# EasyEDA Pro project ProPrj_遥控_2024-09-10.epro

# Schematic Schematic1
Board Name: Board1; Create Date: 2024-09-09
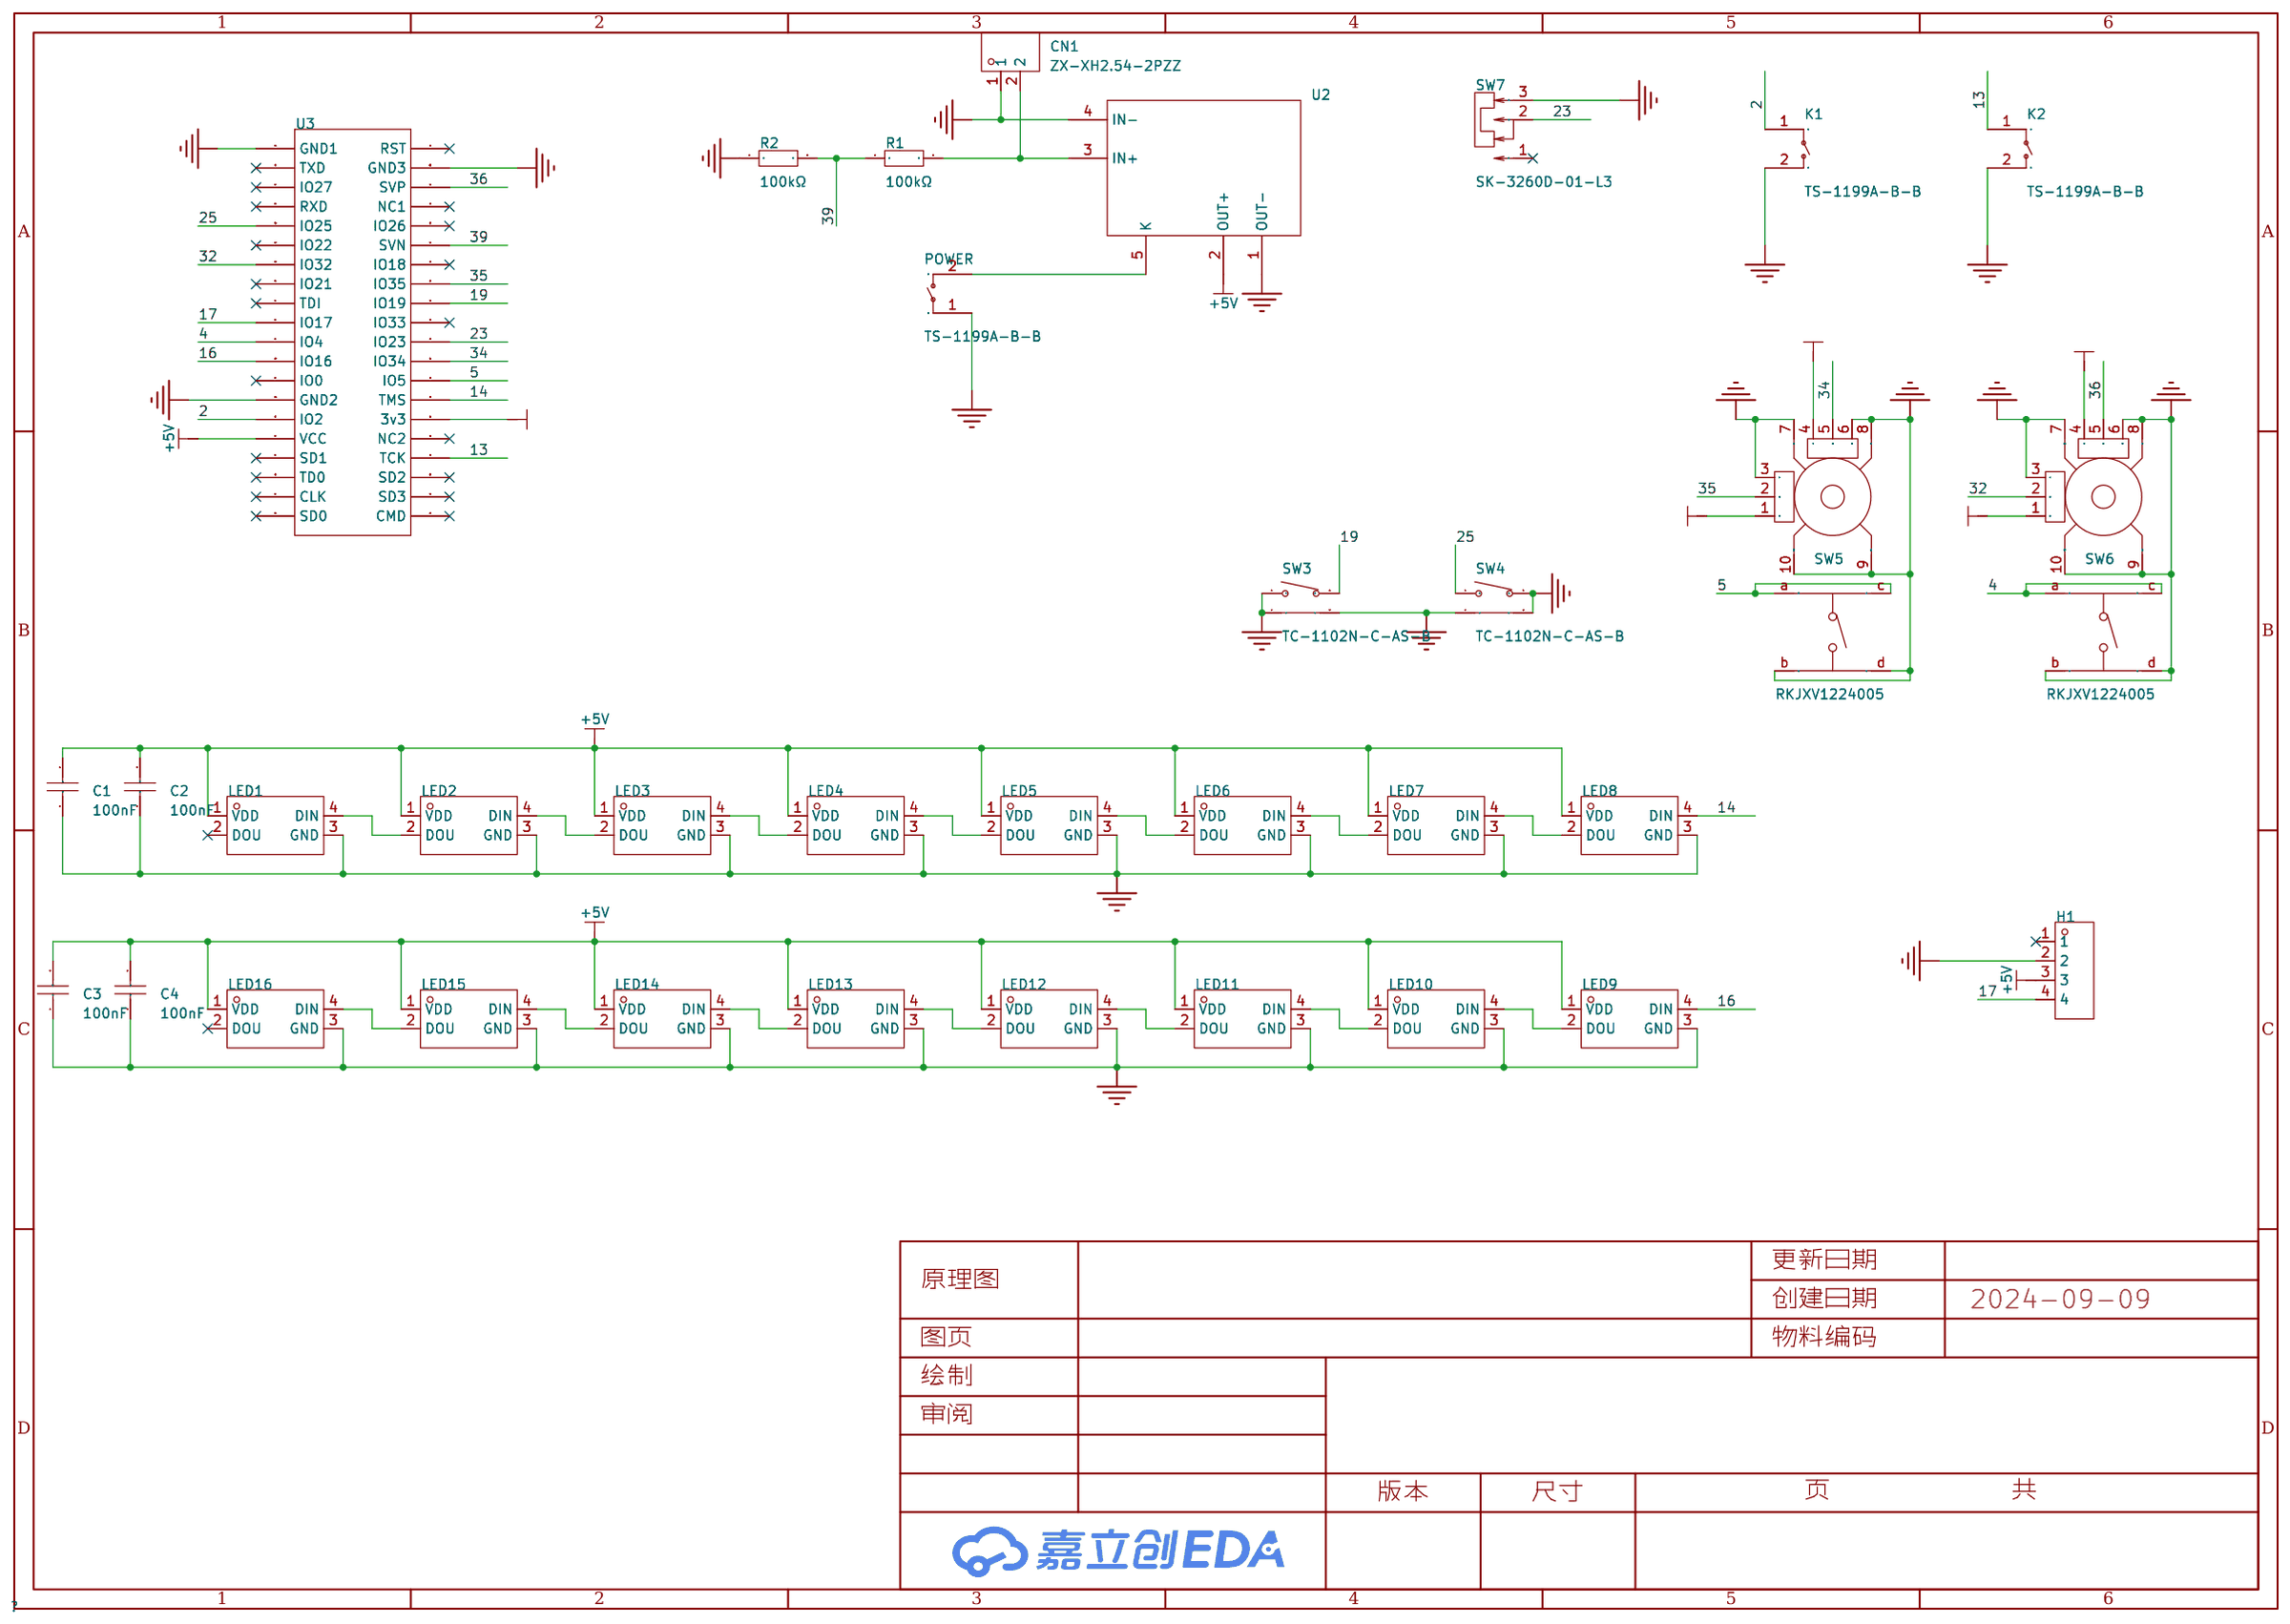
[diagram p0: schematic sheet]

## Parts
C1  100nF  [C0805]
C2  100nF  [C0805]
C3  100nF  [C0805]
C4  100nF  [C0805]
CN1  ZX-XH2.54-2PZZ  [CONN-TH_2P-P2.50_HX25003-2A]
H1  -  [HDR-TH_4P-P2.54-V-M]
K1  TS-1199A-B-B  [SW-SMD_L6.0-W6.0-P6.00-LS6.6]
K2  TS-1199A-B-B  [SW-SMD_L6.0-W6.0-P6.00-LS6.6]
LED1  XL-5050RGBC-WS2812B  [LED-SMD_4P-L5.0-W5.0-BL_XL-5050RGBC]
LED2  XL-5050RGBC-WS2812B  [LED-SMD_4P-L5.0-W5.0-BL_XL-5050RGBC]
LED3  XL-5050RGBC-WS2812B  [LED-SMD_4P-L5.0-W5.0-BL_XL-5050RGBC]
LED4  XL-5050RGBC-WS2812B  [LED-SMD_4P-L5.0-W5.0-BL_XL-5050RGBC]
LED5  XL-5050RGBC-WS2812B  [LED-SMD_4P-L5.0-W5.0-BL_XL-5050RGBC]
LED6  XL-5050RGBC-WS2812B  [LED-SMD_4P-L5.0-W5.0-BL_XL-5050RGBC]
LED7  XL-5050RGBC-WS2812B  [LED-SMD_4P-L5.0-W5.0-BL_XL-5050RGBC]
LED8  XL-5050RGBC-WS2812B  [LED-SMD_4P-L5.0-W5.0-BL_XL-5050RGBC]
LED9  XL-5050RGBC-WS2812B  [LED-SMD_4P-L5.0-W5.0-BL_XL-5050RGBC]
LED10  XL-5050RGBC-WS2812B  [LED-SMD_4P-L5.0-W5.0-BL_XL-5050RGBC]
LED11  XL-5050RGBC-WS2812B  [LED-SMD_4P-L5.0-W5.0-BL_XL-5050RGBC]
LED12  XL-5050RGBC-WS2812B  [LED-SMD_4P-L5.0-W5.0-BL_XL-5050RGBC]
LED13  XL-5050RGBC-WS2812B  [LED-SMD_4P-L5.0-W5.0-BL_XL-5050RGBC]
LED14  XL-5050RGBC-WS2812B  [LED-SMD_4P-L5.0-W5.0-BL_XL-5050RGBC]
LED15  XL-5050RGBC-WS2812B  [LED-SMD_4P-L5.0-W5.0-BL_XL-5050RGBC]
LED16  XL-5050RGBC-WS2812B  [LED-SMD_4P-L5.0-W5.0-BL_XL-5050RGBC]
POWER  TS-1199A-B-B  [SW-SMD_L6.0-W6.0-P6.00-LS6.6]
R1  100kΩ  [R0805]
R2  100kΩ  [R0805]
SW3  TC-1102N-C-AS-B  [SW-TH_TC-1102N-C-AS-B]
SW4  TC-1102N-C-AS-B  [SW-TH_TC-1102N-C-AS-B]
SW5  RKJXV1224005  [SW-TH_RKJXV1224005]
SW6  RKJXV1224005  [SW-TH_RKJXV1224005]
SW7  SK-3260D-01-L3  [SW-TH_SK-3260D-01-LX]
U2  -  [5V模块]
U3  -  [ESP32MINIKIT]

## Library data of the parts
C1-C4 = CC0805KRX7R9BB104: 容值:100nF;精度:±10%;额定电压:50V;材质(温度系数):X7R;; LCSC Part Name: 100nF ±10% 50V; Supplier Part: C49678; Manufacturer: YAGEO(国巨); Supplier Footprint: 0805; JLCPCB Part Class: 基础库; Datasheet: https://atta.szlcsc.com/upload/public/pdf/source/20180224/C181747_15194369449651363981.pdf; Supplier: LCSC; Tolerance: ±10%; Voltage Rated: 50V; Temperature Coefficient: X7R
CN1 = ZX-XH2.54-2PZZ: 插针结构:1x2P;间距:2.54mm;安装方式:直插;参考系列:XH;总PIN数:2P;排数:1;每排PIN数:2;行距:-;额定电流:3A;触头材质:黄铜;触头镀层:锡;工作温度范围:-25℃~+85℃;; Supplier Part: C7429632; Manufacturer: Megastar(兆星); Supplier Footprint: 插件,P=2.54mm; JLCPCB Part Class: 扩展库; Datasheet: https://atta.szlcsc.com/upload/public/pdf/source/20230619/19BA6947230AA44A04D3EDD65E618FD0.pdf; Supplier: LCSC; Pins Structure: 1x2P; Pitch: 2.54mm; Mounting Style: 直插; Reference Series: XH; Number of Pins: 2P; Number of Rows: 1; Number of PINs Per Row: 2; Current Rating (Max): 3A; Contact Material: 黄铜; Contact Plating: 锡; Operating Temperature Range: -25℃~+85℃
H1 = HDR-M_2.54_1x4P: Supplier Part: C492403; Supplier Footprint: 插件
K1 K2 POWER = TS-1199A-B-B: 电路结构:单刀单掷;按钮形状:圆形按钮;作用力:200gf;安装方式:立贴;开关长度:6mm;开关宽度:6mm;开关高度:5mm;带支架:不带;触点电流:50mA;额定电压(DC):12V;绝缘电阻:-;带灯:无;机械寿命:10万次;; LCSC Part Name: 6*6*5mm 立贴 轻触开关; Supplier Part: C692476; Manufacturer: XKB Connectivity(中国星坤); Supplier Footprint: SMD; JLCPCB Part Class: 扩展库; Datasheet: https://atta.szlcsc.com/upload/public/pdf/source/20211011/5E46F02732EE66B7CDC1B0DB682D7B62.pdf; Supplier: LCSC; Circuit: 单刀单掷; Actuator Style: 圆形按钮; Operating Force: 200gf; Mounting Style: 立贴; Switch Length: 6mm; Switch Width: 6mm; Switch Height: 5mm; Strike Gundam: 不带; Contact Current: 50mA; Voltage Rating (DC): 12V; Actuator/Cap Color: 黑色; With Lamp: 无; Mechanical Life: 10万次; Operating Temperature: -30℃~+85℃
LED1-LED16 = XL-5050RGBC-WS2812B: 5050七彩幻彩透明贴片LED灯珠 5050 幻彩透明四脚 ws2812B 内置驱动IC; Supplier Part: C2843785; Manufacturer: XINGLIGHT(成兴光); Supplier Footprint: SMD5050; JLCPCB Part Class: 扩展库; Datasheet: https://atta.szlcsc.com/upload/public/pdf/source/20240412/E1004CAA80592E31D08BFE019083806F.pdf; Supplier: LCSC
R1 R2 = 0805W8F1003T5E: 电阻类型:厚膜电阻;阻值:100kΩ;精度:±1%;功率:125mW;最大工作电压:150V;温度系数:±100ppm/℃;; LCSC Part Name: 100kΩ ±1% 125mW 厚膜电阻; Supplier Part: C149504; Manufacturer: UNI-ROYAL(厚声); Supplier Footprint: 0805; JLCPCB Part Class: 基础库; Datasheet: https://atta.szlcsc.com/upload/public/pdf/source/20200306/C422600_1E6D84923E4A46A82E41ADD87F860B5C.pdf; Supplier: LCSC; Type: 厚膜电阻; Tolerance: ±1%; Power(Watts): 125mW; Overload Voltage (Max): 150V; Temperature Coefficient: ±100ppm/℃; Operating Temperature Range: -55℃~+155℃
SW3 SW4 = TC-1102N-C-AS-B: 电路结构:单刀单掷;按钮形状:圆形按钮;作用力:260gf;安装方式:卧插;开关长度:6mm;开关宽度:6mm;开关高度:4.5mm;带支架:带支架;触点电流:50mA;额定电压(DC):12V;绝缘电阻:-;带灯:无;机械寿命:30万次;; LCSC Part Name: 6*6*4.5mm 卧插 轻触开关; Supplier Part: C406151; Manufacturer: XKB Connectivity(中国星坤); Supplier Footprint: 插件; JLCPCB Part Class: 扩展库; Datasheet: https://atta.szlcsc.com/upload/public/pdf/source/20211011/8943A334D21548136505FDDC6F7285B9.pdf; Supplier: LCSC; Circuit: 单刀单掷; Actuator Style: 圆形按钮; Operating Force: 260gf; Mounting Style: 卧插; Switch Length: 6mm; Switch Width: 6mm; Switch Height: 4.5mm; Strike Gundam: 带支架; Contact Current: 50mA; Voltage Rating (DC): 12V; Actuator/Cap Color: 黑色; With Lamp: 无; Pin Style: PC引脚; Mechanical Life: 30万次; Operating Temperature: -30℃~+85℃
SW5 SW6 = RKJXV1224005: 操纵杆复位 中央按动开关 适用于航模玩具遥控器电位器、3D摇杆PS4手柄游戏机、无人机摇杆电位器、工业控制器; Supplier Part: C146170; Manufacturer: ALPSALPINE(阿尔卑斯阿尔派); Supplier Footprint: 插件,13x13mm; JLCPCB Part Class: 扩展库; Datasheet: https://atta.szlcsc.com/upload/public/pdf/source/20180125/C146170_15168615510911301620.pdf; Supplier: LCSC
SW7 = SK-3260D-01-L3: 电路结构:单刀双掷;安装方式:侧插;开关颜色:黑色;额定电流(DC):50mA;额定电压(DC):12V;额定电流(AC):50mA;额定电压(AC):12V;机械寿命:1万次;; LCSC Part Name: 柄长3mm 卧插双档 滑动开关; Supplier Part: C692482; Manufacturer: XKB Connectivity(中国星坤); Supplier Footprint: 插件; JLCPCB Part Class: 扩展库; Datasheet: https://atta.szlcsc.com/upload/public/pdf/source/20211009/221EDC0F79A971BF29F08D53B29B73D7.pdf; Supplier: LCSC; Circuit: 单刀双掷; Actuator Style: 矩形柱状; Pin Style: PC引脚; Switch Length: 9mm; Switch Width: 3.2mm; Switch Height: 3.6mm; Mounting Style: 侧插; Actuator Color: 黑色; Current Rating (DC): 50mA; Voltage Rating (DC): 12V; Current Rating (AC): 50mA; Voltage Rating (AC): 12V; Mechanical Life: 1万次; Operating Temperature: -40℃~+85℃
U2 = 5V模块
U3 = esp32minikit

## Nets
3.3V: SW5.1(B) SW5.4(A) SW6.1(B) SW6.4(A) U3.3v3
+5V: C1.2 C2.2 C3.2 C4.2 H1.3 LED1.1(VDD) LED2.1(VDD) LED3.1(VDD) LED4.1(VDD) LED5.1(VDD) LED6.1(VDD) LED7.1(VDD) LED8.1(VDD) LED9.1(VDD) LED10.1(VDD) LED11.1(VDD) LED12.1(VDD) LED13.1(VDD) LED14.1(VDD) LED15.1(VDD) LED16.1(VDD) U2.2(OUT+) U3.VCC
GND: C1.1 C2.1 C3.1 C4.1 CN1.1 H1.2 K1.2 K2.2 LED1.3(GND) LED2.3(GND) LED3.3(GND) LED4.3(GND) LED5.3(GND) LED6.3(GND) LED7.3(GND) LED8.3(GND) LED9.3(GND) LED10.3(GND) LED11.3(GND) LED12.3(GND) LED13.3(GND) LED14.3(GND) LED15.3(GND) LED16.3(GND) POWER.1 R2.1 SW3.1 SW3.3 SW3.4 SW4.2 SW4.3 SW4.4 SW5.3(A) SW5.6(B) SW5.7(GND) SW5.8(GND) SW5.9(GND) SW5.10(GND) SW5.b SW5.d SW6.3(A) SW6.6(B) SW6.7(GND) SW6.8(GND) SW6.9(GND) SW6.10(GND) SW6.b SW6.d SW7.3 U2.1(OUT-) U2.4(IN-) U3.GND1 U3.GND2 U3.GND3
2: K1.1 U3.IO2
4: SW6.a SW6.c U3.IO4
5: SW5.a SW5.c U3.IO5
13: K2.1 U3.TCK
14: LED8.4(DIN) U3.TMS
16: LED9.4(DIN) U3.IO16
17: H1.4 U3.IO17
19: SW3.2 U3.IO19
23: SW7.2 U3.IO23
25: SW4.1 U3.IO25
32: SW6.2(DTA) U3.IO32
34: SW5.5(DTA) U3.IO34
35: SW5.2(DTA) U3.IO35
36: SW6.5(DTA) U3.SVP
39: R1.1 R2.2 U3.SVN
$1N2649: LED1.4(DIN) LED2.2(DOU)
$1N2655: LED2.4(DIN) LED3.2(DOU)
$1N2662: LED3.4(DIN) LED4.2(DOU)
$1N2669: LED4.4(DIN) LED5.2(DOU)
$1N2676: LED5.4(DIN) LED6.2(DOU)
$1N2683: LED6.4(DIN) LED7.2(DOU)
$1N2690: LED7.4(DIN) LED8.2(DOU)
$1N2754: LED15.2(DOU) LED16.4(DIN)
$1N2758: LED14.2(DOU) LED15.4(DIN)
$1N2762: LED13.2(DOU) LED14.4(DIN)
$1N2766: LED12.2(DOU) LED13.4(DIN)
$1N2770: LED11.2(DOU) LED12.4(DIN)
$1N2774: LED10.2(DOU) LED11.4(DIN)
$1N2778: LED9.2(DOU) LED10.4(DIN)
$1N3572: CN1.2 R1.2 U2.3(IN+)
$1N3580: POWER.2 U2.5(K)

Not connected (* = marked no-connect by the designer): H1 1*; LED1 2(DOU)*; LED16 2(DOU)*; SW7 1*; U3 CLK* CMD* IO0* IO18* IO21* IO22* IO26* IO27* IO33* NC1* NC2* PST(RST)* RXD* SD0* SD1* SD2* SD3* TD0* TDI* TXD*

# Board PCB1
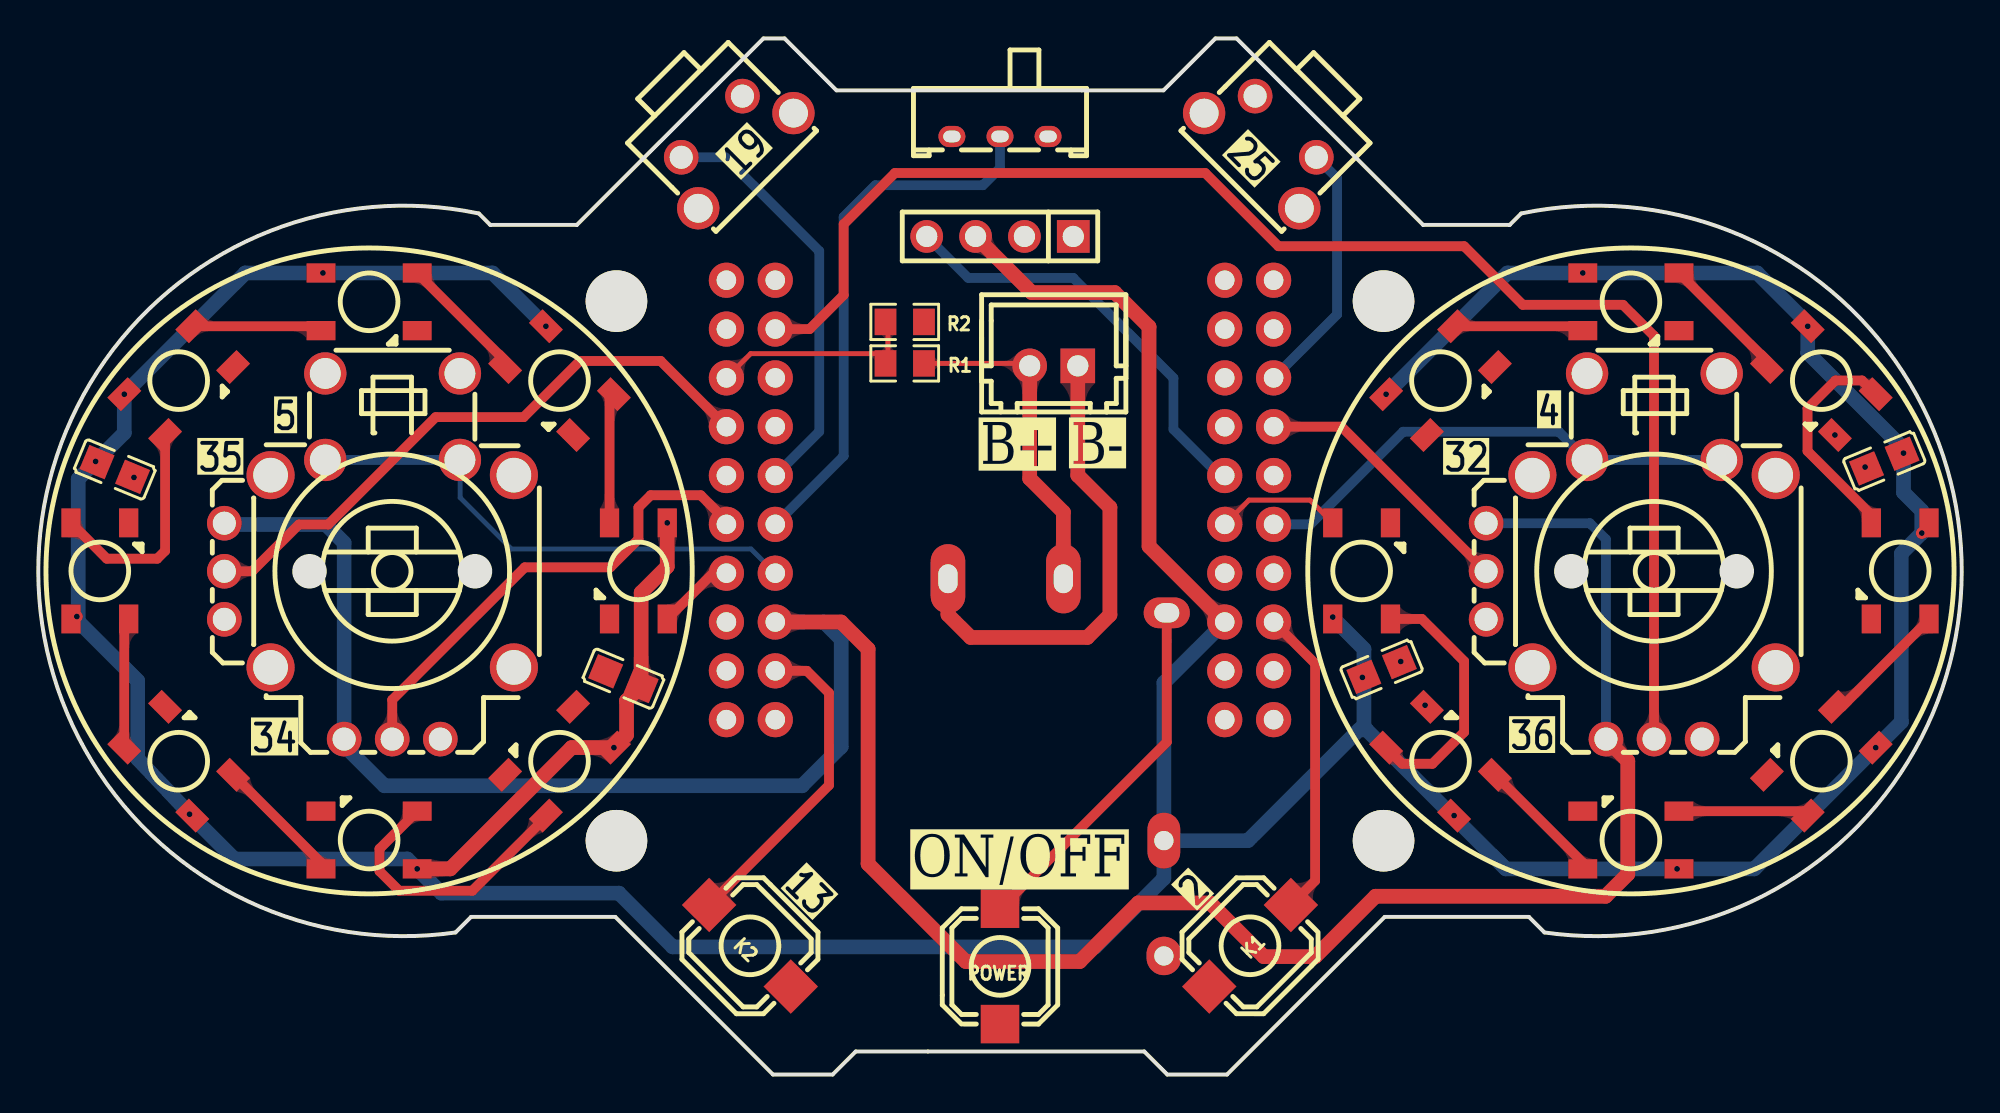
[diagram p1: board, top side]
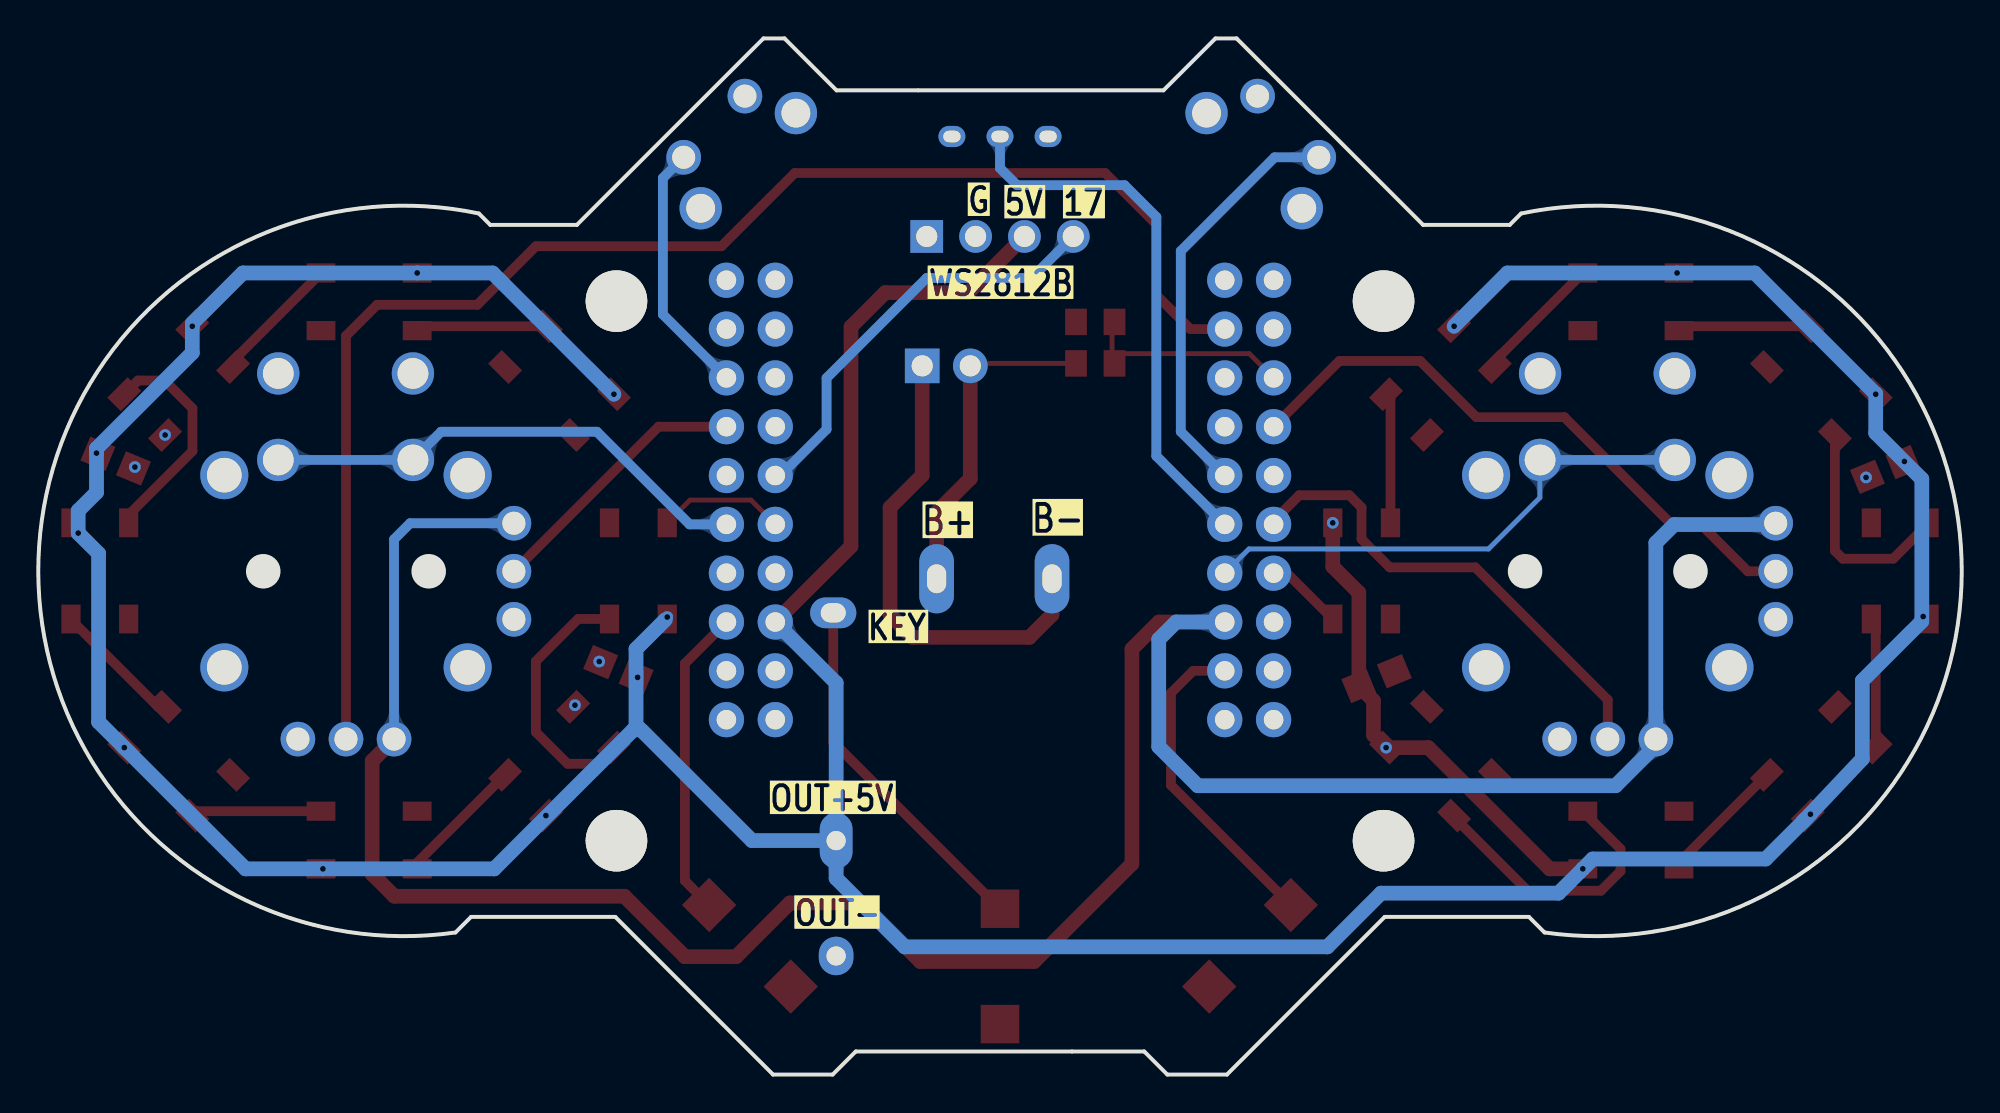
[diagram p2: board, bottom side, seen from below]

Outline 99.98 x 53.9 mm; copper layers: Top Layer, Bottom Layer. Coordinates in mm from the lower left corner of the outline.
Outline path: 21.68,7.39 22.49,8.2 29.99,8.2 38.19,0 41.29,0 42.49,1.2 57.49,1.2 58.69,0 61.79,0 69.99,8.2 77.49,8.2 78.3,7.39 arc(99.98,26.82) 77.08,44.79 76.49,44.2 71.99,44.2 62.29,53.9 61.19,53.9 58.49,51.2 41.49,51.2 38.79,53.9 37.69,53.9 27.99,44.2 23.49,44.2 22.89,44.79 arc(0,26.82) 21.68,7.39
Stack: Top Layer 0.035mm / Dielectric1 1.51mm FR4 er 4.5 / Bottom Layer 0.035mm

## Design rules (mm)
template: JLCPCB Capability(Two Layers Board)
spacing copperThickness1oz (default): track to track 0.102, other pairs 0.152 to 0.3
spacing copperThickness2oz: track to track 0.203, other pairs 0.152 to 0.3
track width copperThickness1oz (default): min 0.127, default 0.254, max 2.54
track width copperThickness2oz: min 0.203, default 0.254, max 2.54
differential pair differentialPair (default): width min 0.127, default 0.254, max 2.54; gap min 0.152, default 0.152
via viaSize (default): diameter min 0.5, default 0.61, max 10; hole min 0.3, default 0.305, max 6.3

## Placement (name value [footprint] x y rotation side)
C1  100nF  [C0805]  3.97 31.48 157.5 top
C2  100nF  [C0805]  30.41 20.59 337.5 top
C3  100nF  [C0805]  95.96 31.91 22.5 top
C4  100nF  [C0805]  69.83 21.07 202.5 top
CN1  ZX-XH2.54-2PZZ  [CONN-TH_2P-P2.50_HX25003-2A]  52.78 36.87 180 top
H1  -  [HDR-TH_4P-P2.54-V-M]  49.99 43.6 180 top
K1  TS-1199A-B-B  [SW-SMD_L6.0-W6.0-P6.00-LS6.6]  62.99 6.7 225 top
K2  TS-1199A-B-B  [SW-SMD_L6.0-W6.0-P6.00-LS6.6]  36.99 6.7 315 top
LED1  XL-5050RGBC-WS2812B  [LED-SMD_4P-L5.0-W5.0-BL_XL-5050RGBC]  27.09 16.3 135 top
LED2  XL-5050RGBC-WS2812B  [LED-SMD_4P-L5.0-W5.0-BL_XL-5050RGBC]  17.19 12.2 90 top
LED3  XL-5050RGBC-WS2812B  [LED-SMD_4P-L5.0-W5.0-BL_XL-5050RGBC]  7.29 16.3 45 top
LED4  XL-5050RGBC-WS2812B  [LED-SMD_4P-L5.0-W5.0-BL_XL-5050RGBC]  3.19 26.2 0 top
LED5  XL-5050RGBC-WS2812B  [LED-SMD_4P-L5.0-W5.0-BL_XL-5050RGBC]  7.29 36.1 315 top
LED6  XL-5050RGBC-WS2812B  [LED-SMD_4P-L5.0-W5.0-BL_XL-5050RGBC]  17.19 40.2 270 top
LED7  XL-5050RGBC-WS2812B  [LED-SMD_4P-L5.0-W5.0-BL_XL-5050RGBC]  27.09 36.1 225 top
LED8  XL-5050RGBC-WS2812B  [LED-SMD_4P-L5.0-W5.0-BL_XL-5050RGBC]  31.19 26.2 180 top
LED9  XL-5050RGBC-WS2812B  [LED-SMD_4P-L5.0-W5.0-BL_XL-5050RGBC]  68.79 26.2 0 top
LED10  XL-5050RGBC-WS2812B  [LED-SMD_4P-L5.0-W5.0-BL_XL-5050RGBC]  72.89 16.3 45 top
LED11  XL-5050RGBC-WS2812B  [LED-SMD_4P-L5.0-W5.0-BL_XL-5050RGBC]  82.79 12.2 90 top
LED12  XL-5050RGBC-WS2812B  [LED-SMD_4P-L5.0-W5.0-BL_XL-5050RGBC]  92.69 16.3 135 top
LED13  XL-5050RGBC-WS2812B  [LED-SMD_4P-L5.0-W5.0-BL_XL-5050RGBC]  96.79 26.2 180 top
LED14  XL-5050RGBC-WS2812B  [LED-SMD_4P-L5.0-W5.0-BL_XL-5050RGBC]  92.69 36.1 225 top
LED15  XL-5050RGBC-WS2812B  [LED-SMD_4P-L5.0-W5.0-BL_XL-5050RGBC]  82.79 40.2 270 top
LED16  XL-5050RGBC-WS2812B  [LED-SMD_4P-L5.0-W5.0-BL_XL-5050RGBC]  72.89 36.1 315 top
NOREF  -  [Pad_e194]  69.93 40.23 0 top
NOREF#2  -  [Pad_e193]  30.05 40.23 0 top
NOREF#3  -  [Pad_e196]  30.05 12.16 0 top
NOREF#4  -  [Pad_e195]  69.93 12.16 0 top
POWER  TS-1199A-B-B  [SW-SMD_L6.0-W6.0-P6.00-LS6.6]  49.99 5.63 90 top
R1  100kΩ  [R0805]  45.04 36.99 0 top
R2  100kΩ  [R0805]  45.04 39.15 180 top
SW3  TC-1102N-C-AS-B  [SW-TH_TC-1102N-C-AS-B]  35.89 48.42 225 top
SW4  TC-1102N-C-AS-B  [SW-TH_TC-1102N-C-AS-B]  63.96 48.42 135 top
SW5  RKJXV1224005  [SW-TH_RKJXV1224005]  17.19 26.96 180 top
SW6  RKJXV1224005  [SW-TH_RKJXV1224005]  82.79 26.96 180 top
SW7  SK-3260D-01-L3  [SW-TH_SK-3260D-01-LX]  49.99 48.8 180 top
U2  -  [5V模块]  58.51 12.17 180 bottom
U3  -  [ESP32MINIKIT]  49.99 30.4 0 bottom

## Footprints (pads in the part's own frame, mm; a bottom-side part is the same pattern mirrored in y, then rotated)
5V模块
  oval 1.8x2 hole 1: 1(0,-6)
  oval 1.7x2.9 hole 1: 2(0,0)
  oval 1.8x3.6 hole 1x1.5: 3(5.225,13.622) 4(11.225,13.622)
  oval 2.4x1.6 hole 1.3x1: 5(-0.15,11.85)
C0805
  rect 1.41x1.35 smd: 1(-1,0) 2(1,0)
CONN-TH_2P-P2.50_HX25003-2A
  rect 1.8x1.8 hole 1.1: 1(-1.25,0)
  round 1.8 hole 1.1: 2(1.25,0)
ESP32MINIKIT
  round 1.829 hole 1.016: 3v3(-11.684,6.858) CLK(14.224,11.938) CMD(-14.224,11.938) GND1(14.224,-10.922) GND2(11.684,4.318) GND3(-14.224,-10.922) IO0(14.224,4.318) IO2(14.224,6.858) IO4(14.224,1.778) IO5(-11.684,4.318) IO16(11.684,1.778) IO17(11.684,-0.762) IO18(-11.684,-3.302) IO19(-11.684,-0.762) IO21(11.684,-3.302) IO22(11.684,-5.842) IO23(-11.684,1.778) IO25(14.224,-5.842) IO26(-11.684,-5.842) IO27(14.224,-8.382) IO32(14.224,-3.302) IO33(-14.224,-0.762) IO34(-14.224,1.778) IO35(-14.224,-3.302) NC1(-14.224,-8.382) NC2(-14.224,6.858) PST(-11.684,-10.922) RXD(11.684,-8.382) SD0(11.684,11.938) SD1(14.224,9.398) SD2(-14.224,9.398) SD3(-11.684,11.938) SVN(-14.224,-5.842) SVP(-11.684,-8.382) TCK(-11.684,9.398) TD0(11.684,9.398) TDI(14.224,-0.762) TMS(-14.224,4.318) TXD(11.684,-10.922) VCC(11.684,6.858)
HDR-TH_4P-P2.54-V-M
  rect 1.7x1.7 hole 1.1: 1(-3.81,0)
  round 1.7 hole 1.1: 2(-1.27,0) 3(1.27,0) 4(3.81,0)
LED-SMD_4P-L5.0-W5.0-BL_XL-5050RGBC
  rect 1x1.5 smd: 1(-1.5,-2.5) 2(1.5,-2.5) 3(1.5,2.5) 4(-1.5,2.5)
Pad_e193
  round 3.2 hole 3.2x2: 1(0,0)
Pad_e194
  round 3.2 hole 3.2x2: 2(0,0)
Pad_e195
  round 3.2 hole 3.2x2: 3(0,0)
Pad_e196
  round 3.2 hole 3.2x2: 4(0,0)
R0805
  rect 1.133x1.377 smd: 1(-1,0) 2(1,0)
SW-SMD_L6.0-W6.0-P6.00-LS6.6
  rect 2x2 smd: 1(-3,0) 2(3,0)
SW-TH_RKJXV1224005
  round 1.8 hole 1.2: 1(7.527,-1.719) 2(7.527,0.781) 3(7.527,3.281) 4(1.298,9.511) 5(-1.202,9.511) 6(-3.703,9.511)
  round 2.5 hole 1.8: 7(-7.527,5.781) 8(-7.527,-4.219) 9(5.122,-4.219) 10(5.122,5.781)
  round 2.2 hole 1.6: a(-4.721,-5.011) b(-4.721,-9.511) c(2.279,-5.011) d(2.279,-9.511)
SW-TH_SK-3260D-01-LX
  oval 1.4x1.1 hole 0.9x0.6: 1(-2.5,0) 2(0,0) 3(2.5,0)
SW-TH_TC-1102N-C-AS-B
  round 1.8 hole 1.2: 1(-2.25,-1.25) 2(2.25,-1.25)
  round 2.2 hole 1.5: 3(3.5,1.25) 4(-3.5,1.25)

## Nets
As in the schematic.

Pads without a net: H1 1; LED1 2; LED16 2; NOREF 2; NOREF#2 1; NOREF#3 4; NOREF#4 3; SW7 1; U3 CLK CMD IO0 IO18 IO21 IO22 IO26 IO27 IO33 NC1 NC2 PST RXD SD0 SD1 SD2 SD3 TD0 TDI TXD

## Via types
v1: diameter 0.61, hole 0.305, Top Layer to Bottom Layer, 24 vias

## Routing (per net, layer and track width the routed paths; a pad name or vN(x,y) marks a point on that pad's centre or on a via; arc(x,y) is an arc through that point)
3.3V: length 141
  Top Layer w0.762: SW6.4 82.63,16.31 82.63,10.43 81.47,9.28 69.51,9.28 66.37,6.13 63.71,6.13 60.91,8.93 57.18,8.93 54.13,5.88 48.21,5.88 43.13,10.96 43.13,22.14 41.73,23.54 U3.3v3
  Bottom Layer w0.508: SW6.1 80.66,28.68 81.49,27.84 SW6.4
  Bottom Layer w0.762: SW5.1 9.73,28.61 14.94,28.61 15.89,27.66 SW5.4 15.89,17.12 17.99,15.02 39.7,15.02 41.73,17.06 41.73,22.64 40.84,23.54 U3.3v3
+5V: length 277.2
  Top Layer w0.762: U3.VCC 57.74,27.48 57.74,38.9 55.96,40.68 51.64,40.68 H1.3 ; v1(32.69,28.7) 32.69,26.43 31.33,25.07 C2.2 30.57,19.45 30.57,17.66 v1(29.92,17.01) 27.72,17.01 21.41,10.7 v1(19.69,10.7)
  Bottom Layer w0.762: U2.2 58.51,10.21 54.94,6.64 32.97,6.64 30.18,9.44 20.95,9.44 v1(19.69,10.7) 19.18,11.21 10.18,11.21 8.24,13.16 ; U2.2 62.88,12.17 68.59,17.87 ; U2.2 58.51,20.38 U3.VCC ; 8.24,13.16 v1(7.86,13.54) ; 8.24,13.16 5.16,16.42 5.16,20.48 2.07,23.58 2.07,30.98 4.46,33.38 v1(4.46,35.39) 4.46,35.41 10.75,41.7 v1(14.79,41.7) 23.61,41.7 v1(26.38,38.93) ; v1(70.06,35.39) 76.37,41.7 v1(80.29,41.7) 89.35,41.7 91.98,39.07 v1(91.98,38.93) 91.98,37.55 96.96,32.57 v1(96.96,32.33) 96.96,30.28 97.91,29.33 v1(97.91,28.17) 96.85,27.11 96.85,18.34 v1(95.52,17.01) 89.21,10.7 v1(85.19,10.7) 76.28,10.7 69.05,17.93 68.66,17.93 68.91,18.18 68.91,22.14 67.39,23.66
  vias: v1(2,23.83) v1(2.97,31.89) v1(67.29,23.8) v1(68.83,20.66) v1(73.6,13.47)
GND: length 24.9
  Top Layer w0.762: U2.4 47.28,23.92 48.47,22.74 54.53,22.74 55.7,23.91 55.7,29.5 54.03,31.17 CN1.1
  vias: v1(4.97,31.06) v1(70.82,21.49) v1(72.09,19.21) v1(93.4,33.27) v1(94.97,31.6)
2: length 16.1
  Top Layer w0.508: K1.1 66.37,10.08 66.37,21.38 U3.IO2
4: length 25.9
  Bottom Layer w0.508: U3.IO4 66.13,28.62 70.94,33.44 79.04,33.44 SW6.c SW6.a
5: length 27
  Bottom Layer w0.254: SW5.a 21.92,31.96 21.92,30.01 24.59,27.34 37.04,27.34 U3.IO5
  Bottom Layer w0.508: SW5.c SW5.a
13: length 16.9
  Top Layer w0.508: K2.1 41.1,15.05 41.1,19.85 39.95,21 U3.TCK
14: length 4.1
  Top Layer w0.508: U3.TMS 35.07,26.08 LED8.4
16: length 6.6
  Top Layer w0.254: LED9.4 66.11,29.88 62.93,29.88 U3.IO16
17: length 22.2
  Bottom Layer w0.508: H1.4 48.34,41.44 53.8,41.44 59.01,36.23 59.01,33.57 61.41,31.16 U3.IO17
19: length 21.8
  Bottom Layer w0.508: U3.IO19 40.59,33.45 40.59,42.84 35.71,47.72 SW3.2
23: length 28.3
  Bottom Layer w0.508: SW7.2 49.99,47.15 49.1,46.27 43.51,46.27 41.86,44.61 41.86,32.18 U3.IO23
25: length 13.3
  Bottom Layer w0.508: SW4.1 67.52,46.64 67.52,39.54 U3.IO25
32: length 14.2
  Top Layer w0.508: U3.IO32 67.74,33.7 SW6.2
34: length 25.4
  Top Layer w0.508: 35.84,28.73 34.43,30.14 31.83,30.14 31.19,29.5 31.19,27.85 29.73,26.39 25.28,26.39 18.39,19.49 SW5.5
35: length 32.1
  Top Layer w0.508: U3.IO35 32.35,37.12 28.15,37.12 25.22,34.2 20.65,34.2 15.06,28.61 13.54,28.61 11.11,26.18 SW5.2
36: length 75.7
  Top Layer w0.508: U3.SVP 40.09,38.78 41.86,40.55 41.86,44.23 44.53,46.9 60.66,46.9 64.47,43.09 74.12,43.09 77.17,40.04 82.37,40.04 83.99,38.43 SW6.5
39: length 11.3
  Top Layer w0.254: R2.2 44.16,39.03 44.16,36.99 43.66,37.5 37.03,37.5 U3.SVN
$1N2649: length 14.7
  Top Layer w0.508: LED1.4 26.38,13.39 22.56,9.56 18.75,9.56 17.73,10.58 17.73,11.74 LED2.2
$1N2655: length 6.8
  Top Layer w0.508: LED2.4 14.69,11.02 LED3.2
$1N2662: length 6.8
  Top Layer w0.508: LED3.4 4.46,23.47 LED4.2
$1N2669: length 11.9
  Top Layer w0.508: LED4.4 3.55,26.83 6.17,26.83 6.58,27.24 6.58,33.27
$1N2676: length 6.8
  Top Layer w0.508: LED5.4 14.46,38.93 LED6.2
$1N2683: length 6.8
  Top Layer w0.508: LED6.4 24.26,37.13 LED7.2
$1N2690: length 6.8
  Top Layer w0.508: LED7.4 29.69,35.16 LED8.2
$1N2754: length 6.8
  Top Layer w0.508: LED15.2 80.06,38.93 LED16.4
$1N2758: length 6.8
  Top Layer w0.508: LED14.2 89.86,37.13 LED15.4
$1N2762: length 11.8
  Top Layer w0.508: LED14.4 94.8,36.11 93.42,36.11 91.97,34.66 91.97,32.43 95.29,29.12 LED13.2
$1N2766: length 6.4
  Top Layer w0.508: 93.4,19.13 93.75,19.13 98.03,23.41
$1N2770: length 6.8
  Top Layer w0.508: LED12.4 91.75,13.7 LED11.2
$1N2774: length 6.8
  Top Layer w0.508: LED11.4 80.29,11.02 LED10.2
$1N2778: length 13.5
  Top Layer w0.508: LED10.4 70.9,16.17 72.47,16.17 74.12,17.82 74.12,21.5 71.92,23.7 LED9.2
$1N3572: length 17.4
  Top Layer w0.254: R1.2 51.41,36.99 CN1.2
  Top Layer w0.762: CN1.2 51.53,31.01 53.28,29.25 U2.3
$1N3580: length 19
  Top Layer w0.508: POWER.2 58.66,17.3 U2.5

## Copper pours and planes (outline as drawn; the poured copper is in the pictures)
GND on Top Layer: -10.84,67.09 107.01,67.09 107.01,-3.39 -10.84,-3.39
GND on Bottom Layer: -6.27,61.25 105.23,61.25 105.23,-1.87 -6.27,-1.87

Small or netless copper shapes (teardrops, artwork), in the pictures only: 66 on Top Layer, 30 on Bottom Layer

## Text on the board
Bottom Silkscreen Layer: 17 | 5V | G | WS2812B | KEY | OUT- | OUT+5V | B- | B+
Top Silkscreen Layer: 35 | 34 | 5 | 32 | 36 | 4 | 19 | 2 | 13 | 25 | ON/OFF | B+ | B-
